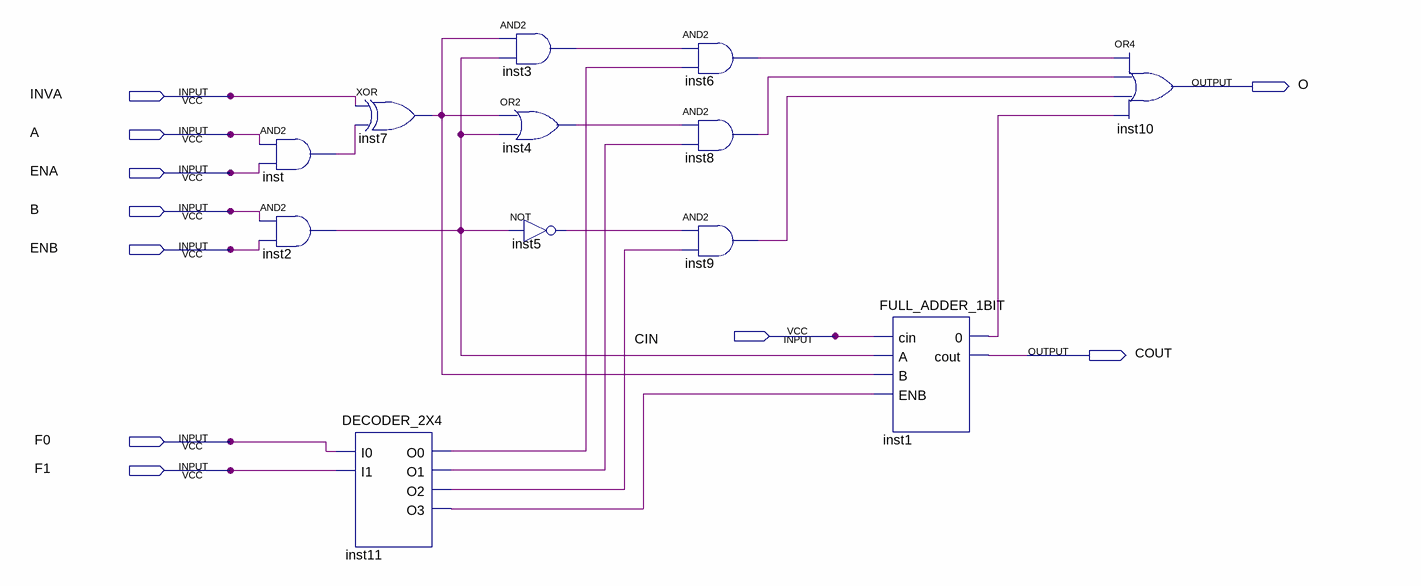
[diagram p0: schematic sheet]
// Quartus schematic ULA_1_bit.bdf as structural Verilog: 12 symbols, 10 pins
module ULA_1_bit (
  input  INVA,
  input  A,
  input  ENA,
  input  B,
  input  ENB,
  input  CIN,
  input  F0,
  input  F1,
  output O,
  output COUT
);

  wire inst1_0, inst2_out, inst3_out, inst4_out, inst5_out, inst6_out, inst7_out, inst8_out, inst9_out,
       inst11_o0, inst11_o1, inst11_o2, inst11_o3, inst_out;

  and inst (inst_out, A, ENA);
  and inst2 (inst2_out, B, ENB);
  xor inst7 (inst7_out, INVA, inst_out);
  DECODER_2X4 inst11 (.I0(F0), .I1(F1), .O0(inst11_o0), .O1(inst11_o1), .O2(inst11_o2), .O3(inst11_o3));
  and inst3 (inst3_out, inst7_out, inst2_out);
  or inst4 (inst4_out, inst7_out, inst2_out);
  not inst5 (inst5_out, inst2_out);
  and inst6 (inst6_out, inst3_out, inst11_o0);
  and inst8 (inst8_out, inst4_out, inst11_o1);
  and inst9 (inst9_out, inst5_out, inst11_o2);
  FULL_ADDER_1BIT inst1 (.cin(CIN), .A(inst2_out), .B(inst7_out), .ENB(inst11_o3), .\0 (inst1_0), .cout(COUT));
  or inst10 (O, inst6_out, inst8_out, inst9_out, inst1_0);
endmodule
